# EAGLE schematic LPRD Valve Control V2.1 (EAGLE 8.6.0)

## Sheet 1 of 2
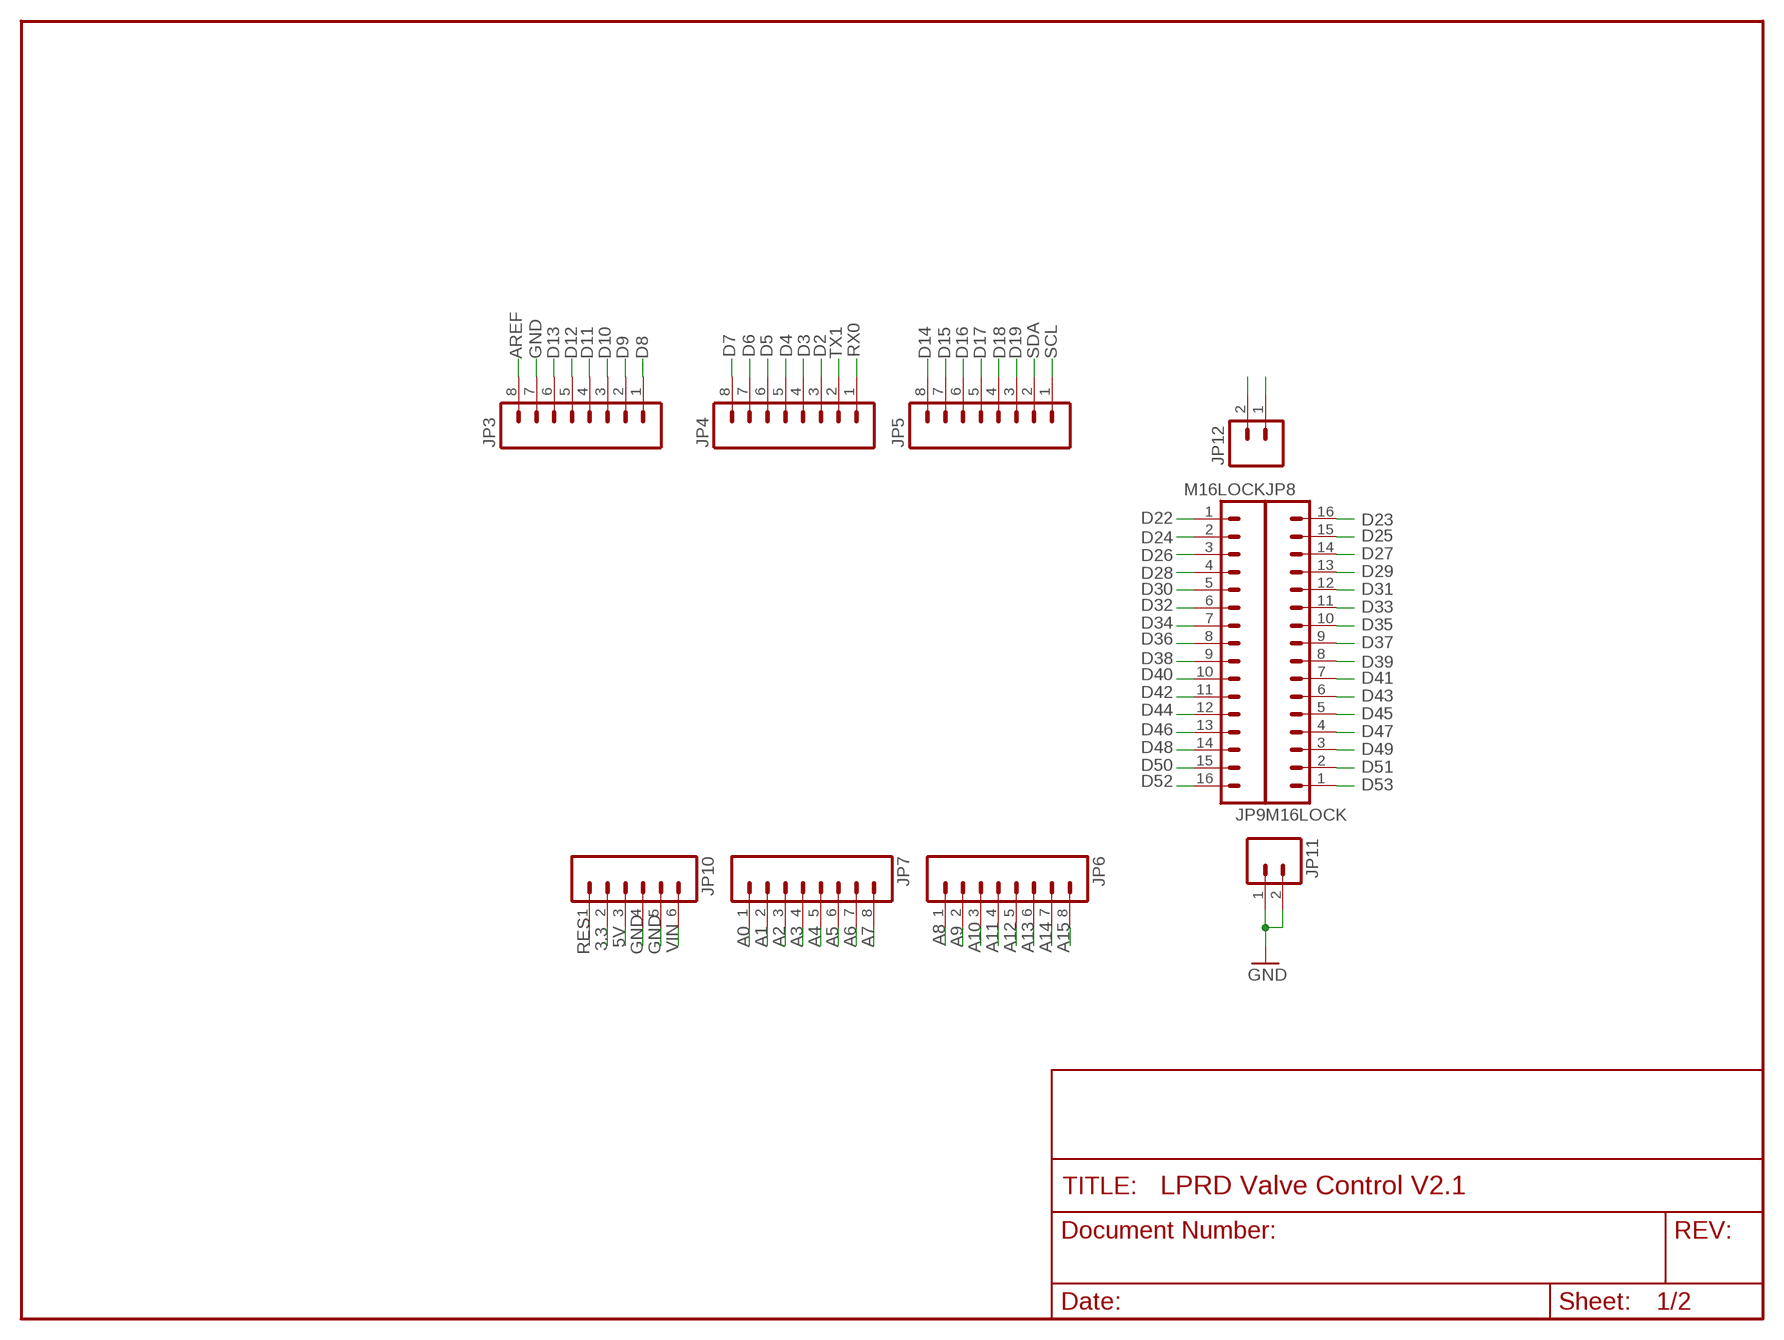
[diagram p0: schematic, sheet 1]

### Parts
JP3  M08LOCK  [1X08_LOCK]
JP4  M08LOCK  [1X08_LOCK]
JP5  M08LOCK  [1X08_LOCK]
JP6  M08LOCK  [1X08_LOCK]
JP7  M08LOCK  [1X08_LOCK]
JP8  M16LOCK  [1X16_LOCK]
JP9  M16LOCK  [1X16_LOCK]
JP10  M06LOCK  [1X06_LOCK]
JP11  M02LOCK  [1X02_LOCK]
JP12  M02LOCK  [1X02_LOCK]

### Nets
3.3: JP10.2
5V: JP10.3
5V@1: JP12.1 JP12.2 ; also sheet 2
A0: JP7.1
A1: JP7.2
A2: JP7.3
A3: JP7.4
A4: JP7.5
A5: JP7.6
A6: JP7.7
A7: JP7.8
A8: JP6.1
A9: JP6.2
A10: JP6.3
A11: JP6.4
A12: JP6.5
A13: JP6.6
A14: JP6.7
A15: JP6.8
AREF: JP3.8
D2: JP4.3
D3: JP4.4
D4: JP4.5
D5: JP4.6
D6: JP4.7
D7: JP4.8
D8: JP3.1
D9: JP3.2
D10: JP3.3
D11: JP3.4
D12: JP3.5
D13: JP3.6
D14: JP5.8
D15: JP5.7
D16: JP5.6
D17: JP5.5
D18: JP5.4
D19: JP5.3
D22: JP9.1
D23: JP8.16
D24: JP9.2
D25: JP8.15
D26: JP9.3
D27: JP8.14
D28: JP9.4
D29: JP8.13
D30: JP9.5
D31: JP8.12
D32: JP9.6
D33: JP8.11
D34: JP9.7
D35: JP8.10
D36: JP9.8
D37: JP8.9 ; also sheet 2
D38: JP9.9 ; also sheet 2
D39: JP8.8 ; also sheet 2
D40: JP9.10 ; also sheet 2
D41: JP8.7
D42: JP9.11
D43: JP8.6
D44: JP9.12
D45: JP8.5
D46: JP9.13
D47: JP8.4
D48: JP9.14
D49: JP8.3
D50: JP9.15
D51: JP8.2
D52: JP9.16
D53: JP8.1
GND: JP3.7 JP10.4 JP10.5 JP11.1 JP11.2 ; also sheet 2
RES: JP10.1
RX0: JP4.1
SCL: JP5.1
SDA: JP5.2
TX1: JP4.2
VIN: JP10.6

## Sheet 2 of 2: Valves
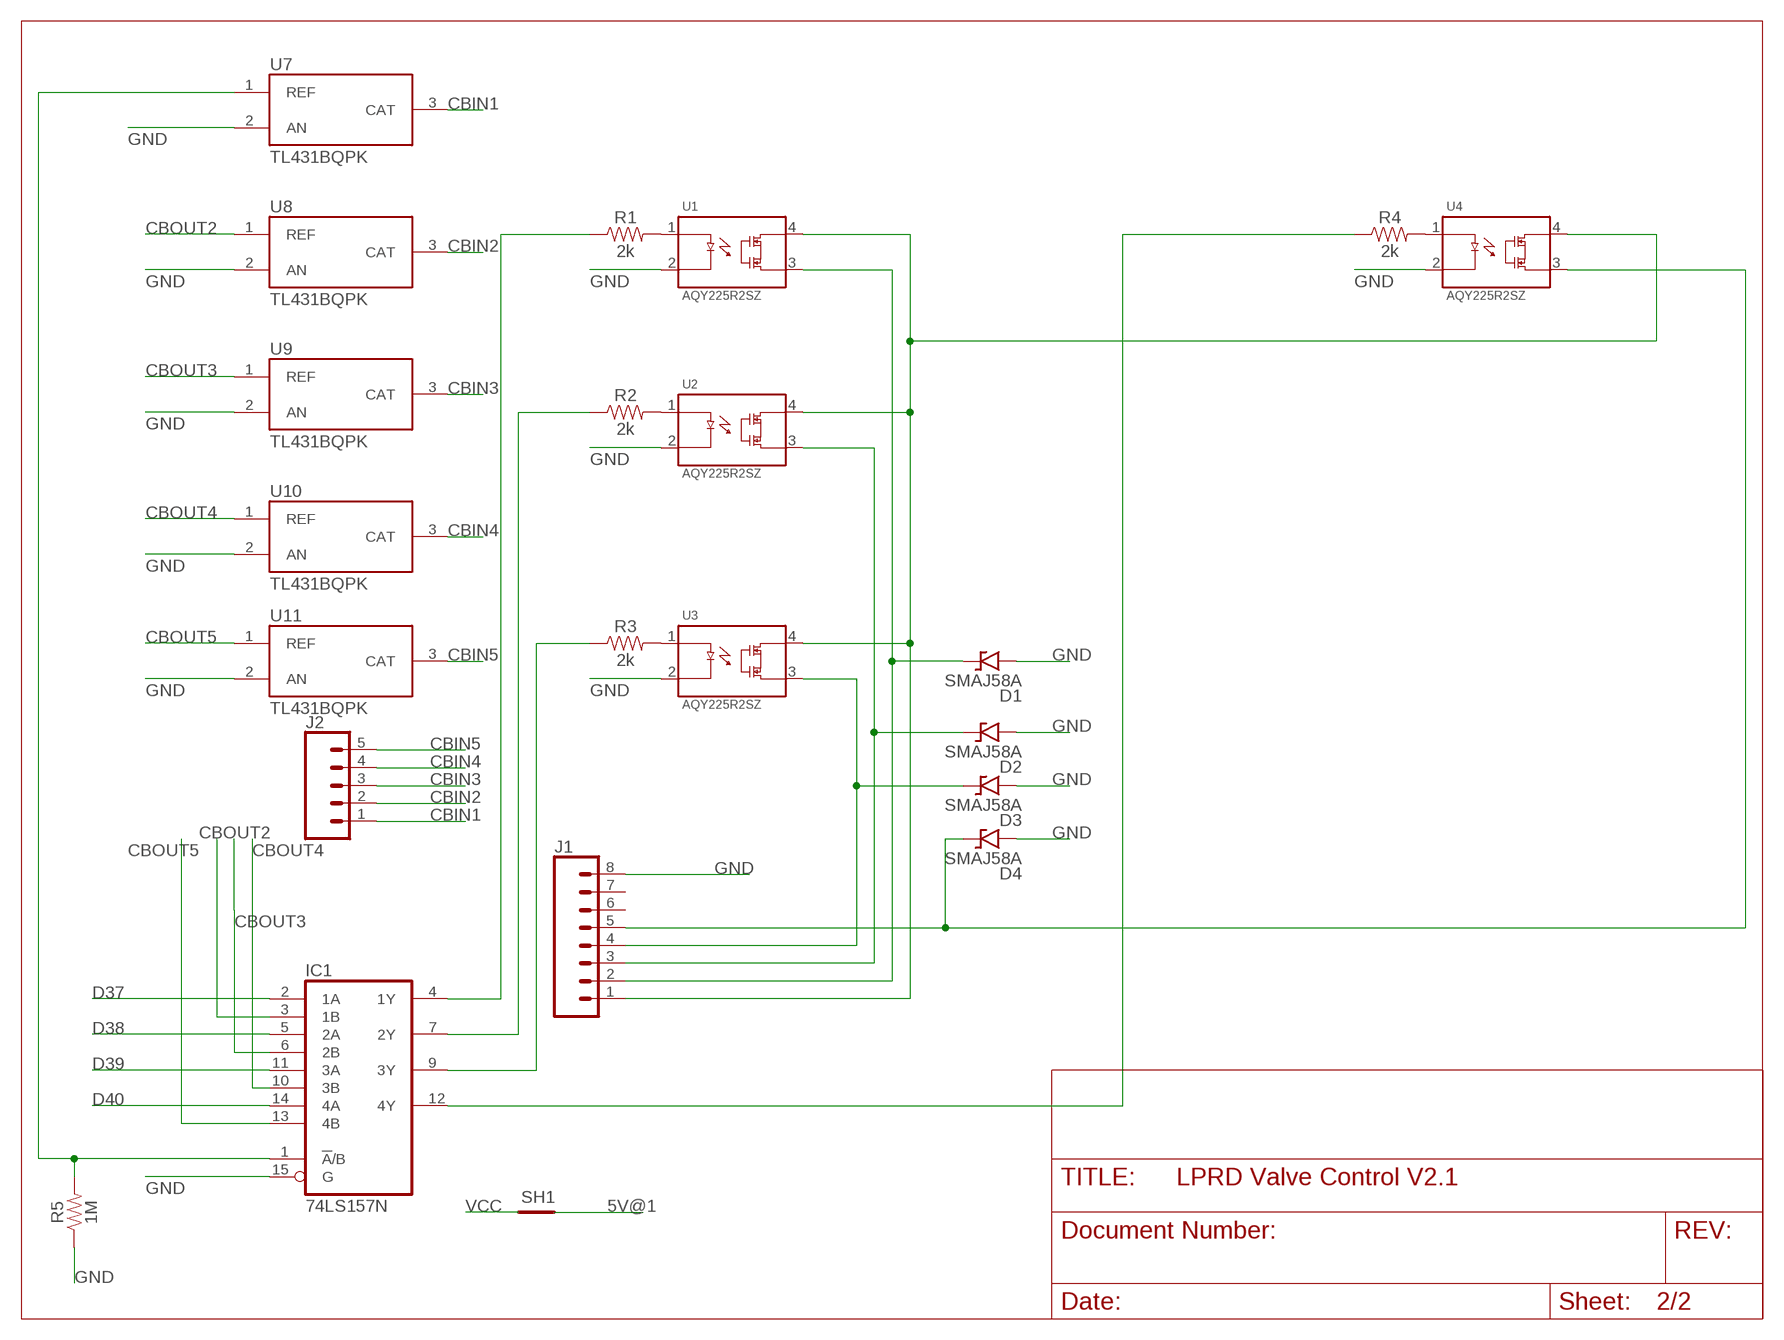
[diagram p1: schematic, sheet 2]

### Parts
D1  SMAJ58A  [SMA]
D2  SMAJ58A  [SMA]
D3  SMAJ58A  [SMA]
D4  SMAJ58A  [SMA]
IC1  74LS157N  [DIL16]
J1  CONN_08"  [1X08]
J2  CONN_05  [1X05]
R1  2k  RESISTOR0805  [0805]
R2  2k  RESISTOR0805  [0805]
R3  2k  RESISTOR0805  [0805]
R4  2k  RESISTOR0805  [0805]
R5  1M  RESISTOR0805  [0805]
SH1  SHORTT5  [SHORT_TOP-50]
U1  AQY225R2SZ  [SOIC254P680X220-4N]
U2  AQY225R2SZ  [SOIC254P680X220-4N]
U3  AQY225R2SZ  [SOIC254P680X220-4N]
U4  AQY225R2SZ  [SOIC254P680X220-4N]
U7  TL431BQPK  [VREG_TL431BQPK]
U8  TL431BQPK  [VREG_TL431BQPK]
U9  TL431BQPK  [VREG_TL431BQPK]
U10  TL431BQPK  [VREG_TL431BQPK]
U11  TL431BQPK  [VREG_TL431BQPK]

### Nets
5V@1: SH1.2 ; also sheet 1
CBIN1: J2.1 U7.3(CAT)
CBIN2: J2.2 U8.3(CAT)
CBIN3: J2.3 U9.3(CAT)
CBIN4: J2.4 U10.3(CAT)
CBIN5: J2.5 U11.3(CAT)
CBOUT2: IC1.3(1B) U8.1(REF)
CBOUT3: IC1.6(2B) U9.1(REF)
CBOUT4: IC1.10(3B) U10.1(REF)
CBOUT5: IC1.13(4B) U11.1(REF)
D37: IC1.2(1A) ; also sheet 1
D38: IC1.5(2A) ; also sheet 1
D39: IC1.11(3A) ; also sheet 1
D40: IC1.14(4A) ; also sheet 1
GND: D1.A D2.A D3.A D4.A IC1.15(G) J1.8 R5.1 U1.2 U2.2 U3.2 U4.2 U7.2(AN) U8.2(AN) U9.2(AN) U10.2(AN) U11.2(AN) ; also sheet 1
N$1: R1.2 U1.1
N$2: R2.2 U2.1
N$3: R3.2 U3.1
N$4: R4.2 U4.1
N$7: J1.1 U1.4 U2.4 U3.4 U4.4
N$9: D1.C J1.2 U1.3
N$10: D2.C J1.3 U2.3
N$11: D3.C J1.4 U3.3
N$12: D4.C J1.5 U4.3
N$18: IC1.4(1Y) R1.1
N$19: IC1.7(2Y) R2.1
N$20: IC1.9(3Y) R3.1
N$21: IC1.12(4Y) R4.1
N$22: IC1.1(!A!/B) R5.2 U7.1(REF)
VCC: SH1.1
Unconnected: J1.6 J1.7

## Power pins joined to a net without a drawn wire
GND: IC1.8(GND)
VCC: IC1.16(VCC)

## Library data of the parts
D1-D4 = SMAJ58A:SMAJ58A; DESCRIPTION: TVS DIODE 58VWM 93.6VC DO214AC; DIGI-KEY_PART_NUMBER: SMAJ58ABTR-ND; DIGI-KEY_PURCHASE_URL: https://www.digikey.com/product-detail/en/bourns-inc/SMAJ58A/SMAJ58ABTR-ND/2254713?WT.z_cid=ref_snapeda&utm_source=snapeda&utm_medium=aggregator&utm_campaign=buynow; MF: Bourns; MP: SMAJ58A; PACKAGE: DO-214AC-214 Taiwan Semiconductor
IC1 = 74xx-us:74*157: Quadruple 2-line to 1-line data SELECTOR/MULTIPLEXER
J1 = SparkFun-Connectors:CONN_08: Multi connection point. Often used as Generic Header-pin footprint for 0.1 inch spaced/style header connections On any of the 0.1 inch spaced packages, you can populate with these: Break Away Headers - Straight <https://www.sparkfun.com/products/116> (PRT-00116) Break Away Male Headers - Right Angle <https://www.sparkfun.com/products/553> (PRT-00553) Female Headers <https://www.sparkfun.com/products/115> (PRT-00115) Break Away Headers - Machine Pin <https://www.sparkfun.com/products/117> (PRT-00117) Break Away Female Headers - Swiss Machine Pin <https://www.sparkfun.com/products/743> (PRT-00743) Arduino Stackable Header - 8 Pin <https://www.sparkfun.com/products/9279> (PRT-09279) For SCREWTERMINALS and SPRING TERMINALS visit here: Screw Terimnals on SparkFun.com <https://www.sparkfun.com/search/results?term=Screw+Terminals> (5mm/3.5mm/2.54mm spacing) This device is also useful as a general connection point to wire up your design to another part of your project. Our various solder wires solder well into these plated through hole pads. Hook-Up Wire - Assortment (Stranded, 22 AWG) <https://www.sparkfun.com/products/11375> (PRT-11375) Hook-Up Wire - Assortment (Solid Core, 22 AWG) <https://www.sparkfun.com/products/11367> (PRT-11367) View the entire wire category on our website here <https://www.sparkfun.com/categories/141> Special notes: Molex polarized connector foot print use with SKU : PRT-08231 with associated crimp pins and housings. 1MM SMD Version SKU: PRT-10208 NOTES ON THE VARIANTS LOCK and LOCK_LONGPADS... This footprint was designed to help hold the alignment of a through-hole component (i.e. 6-pin header) while soldering it into place. You may notice that each hole has been shifted either up or down by 0.005 of an inch from it's more standard position (which is a perfectly straight line). This slight alteration caused the pins (the squares in the middle) to touch the edges of the holes. Because they are alternating, it causes a "brace" to hold the component in place. 0.005 has proven to be the perfect amount of "off-center" position when using our standard breakaway headers. Although looks a little odd when you look at the bare footprint, once you have a header in there, the alteration is very hard to notice. Also,if you push a header all the way into place, it is covered up entirely on the bottom side.; PROD_ID: CONN-08438
J2 = SparkFun-Connectors:CONN_05: Multi connection point. Often used as Generic Header-pin footprint for 0.1 inch spaced/style header connections On any of the 0.1 inch spaced packages, you can populate with these: Break Away Headers - Straight <https://www.sparkfun.com/products/116> (PRT-00116) Break Away Male Headers - Right Angle <https://www.sparkfun.com/products/553> (PRT-00553) Female Headers <https://www.sparkfun.com/products/115> (PRT-00115) Break Away Headers - Machine Pin <https://www.sparkfun.com/products/117> (PRT-00117) Break Away Female Headers - Swiss Machine Pin <https://www.sparkfun.com/products/743> (PRT-00743) For SCREWTERMINALS and SPRING TERMINALS visit here: Screw Terimnals on SparkFun.com <https://www.sparkfun.com/search/results?term=Screw+Terminals> (5mm/3.5mm/2.54mm spacing) This device is also useful as a general connection point to wire up your design to another part of your project. Our various solder wires solder well into these plated through hole pads. Hook-Up Wire - Assortment (Stranded, 22 AWG) <https://www.sparkfun.com/products/11375> (PRT-11375) Hook-Up Wire - Assortment (Solid Core, 22 AWG) <https://www.sparkfun.com/products/11367> (PRT-11367) View the entire wire category on our website here <https://www.sparkfun.com/categories/141> Special notes: Molex polarized connector foot print use with SKU : PRT-08231 with associated crimp pins and housings. 1MM SMD Version SKU: PRT-10208
JP3-JP7 = SparkFun:M08: Header 8 Standard 8-pin 0.1" header. Use with straight break away headers (SKU : PRT-00116), right angle break away headers (PRT-00553), swiss pins (PRT-00743), machine pins (PRT-00117), and female headers (PRT-00115).
JP8 JP9 = SparkFun:M16
JP10 = SparkFun:M06: Header 6 Standard 6-pin 0.1" header. Use with straight break away headers (SKU : PRT-00116), right angle break away headers (PRT-00553), swiss pins (PRT-00743), machine pins (PRT-00117), and female headers (PRT-00115). Molex polarized connector foot print use with SKU : PRT-08094 with associated crimp pins and housings. NOTES ON THE VARIANTS LOCK and LOCK_LONGPADS... This footprint was designed to help hold the alignment of a through-hole component (i.e. 6-pin header) while soldering it into place. You may notice that each hole has been shifted either up or down by 0.005 of an inch from it's more standard position (which is a perfectly straight line). This slight alteration caused the pins (the squares in the middle) to touch the edges of the holes. Because they are alternating, it causes a "brace" to hold the component in place. 0.005 has proven to be the perfect amount of "off-center" position when using our standard breakaway headers. Although looks a little odd when you look at the bare footprint, once you have a header in there, the alteration is very hard to notice. Also, if you push a header all the way into place, it is covered up entirely on the bottom side. This idea of altering the position of holes to aid alignment will be further integrated into the Sparkfun Library for other footprints. It can help hold any component with 3 or more connection pins.
JP11 JP12 = SparkFun:M02: Header 2 Standard 2-pin 0.1" header. Use with straight break away headers (SKU : PRT-00116), right angle break away headers (PRT-00553), swiss pins (PRT-00743), machine pins (PRT-00117), and female headers (PRT-00115). Molex polarized connector foot print use with SKU : PRT-08233 with associated crimp pins and housings.
R1-R5 = SparkFun-Resistors:RESISTOR: Generic Resistor Package
SH1 = shorts:SHORT: Short between two nets; BOM: no
U1-U4 = 4SOP:AQY225R2SZ: AQY Photomos Series 0.15 A 80 V 15 Ohm SMT 1 Channel Solid State Relay - SOP-4; DESCRIPTION: Relay Opto Ac/Dc 80v 150ma 4-Sop; DIGI-KEY_PART_NUMBER: AQY225R2SZ-ND; DIGI-KEY_PURCHASE_URL: https://www.digikey.com/product-detail/en/panasonic-electric-works/AQY225R2SZ/AQY225R2SZ-ND/4757870?WT.z_cid=ref_snapeda; MF: Panasonic; MP: AQY225R2SZ; PACKAGE: SOP-4 Panasonic
U7-U11 = Vreg:TL431BQPK: V-Ref Adjustable 2.495V to 36V 100mA 4-Pin(3+Tab) SOT-89 T/R; AVAILABILITY: Good; DESCRIPTION: V-Ref Adjustable 2.495V to 36V 100mA 4-Pin(3+Tab) SOT-89 T/R; MF: Texas Instruments; MP: TL431BQPK; PACKAGE: SOT-89-3 Texas Instruments; PRICE: 0.33 USD